# Altium schematic sheet 4_bootleg-ev-periferals.SchDoc: =ProjectTitle
size A4; Address1: github.com/4pplet/bootlegs; Address2: Licence: CERN-OHL-S; Address4: www.4pplet.com; SheetNumber: 4; SheetTotal: 4
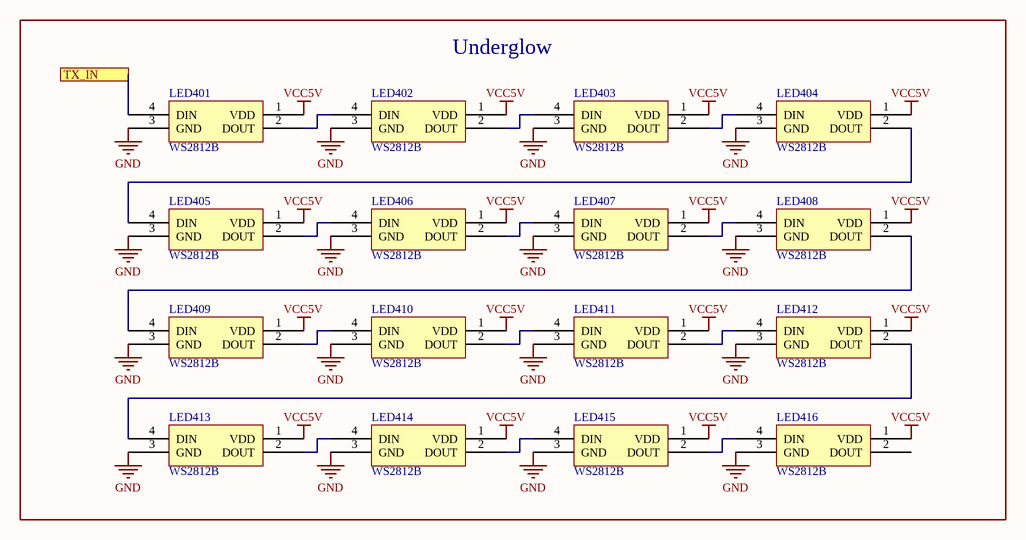
[diagram p0: 4_bootleg-ev-periferals.SchDoc]

## Parts
LED401  WS2812B  [WS2812B - 2020]
LED402  WS2812B  [WS2812B - 2020]
LED403  WS2812B  [WS2812B - 2020]
LED404  WS2812B  [WS2812B - 2020]
LED405  WS2812B  [WS2812B - 2020]
LED406  WS2812B  [WS2812B - 2020]
LED407  WS2812B  [WS2812B - 2020]
LED408  WS2812B  [WS2812B - 2020]
LED409  WS2812B  [WS2812B - 2020]
LED410  WS2812B  [WS2812B - 2020]
LED411  WS2812B  [WS2812B - 2020]
LED412  WS2812B  [WS2812B - 2020]
LED413  WS2812B  [WS2812B - 2020]
LED414  WS2812B  [WS2812B - 2020]
LED415  WS2812B  [WS2812B - 2020]
LED416  WS2812B  [WS2812B - 2020]

## Blocks framed on the sheet
Underglow: LED401-LED416

## Ports
TX_IN

## Nets
GND: LED401.3(GND) LED402.3(GND) LED403.3(GND) LED404.3(GND) LED405.3(GND) LED406.3(GND) LED407.3(GND) LED408.3(GND) LED409.3(GND) LED410.3(GND) LED411.3(GND) LED412.3(GND) LED413.3(GND) LED414.3(GND) LED415.3(GND) LED416.3(GND)
VCC5V: LED401.1(VDD) LED402.1(VDD) LED403.1(VDD) LED404.1(VDD) LED405.1(VDD) LED406.1(VDD) LED407.1(VDD) LED408.1(VDD) LED409.1(VDD) LED410.1(VDD) LED411.1(VDD) LED412.1(VDD) LED413.1(VDD) LED414.1(VDD) LED415.1(VDD) LED416.1(VDD)
TX_IN: LED401.4(DIN) ; port TX_IN
NetLED401_2: LED401.2(DOUT) LED402.4(DIN)
NetLED402_2: LED402.2(DOUT) LED403.4(DIN)
NetLED403_2: LED403.2(DOUT) LED404.4(DIN)
NetLED404_2: LED404.2(DOUT) LED405.4(DIN)
NetLED405_2: LED405.2(DOUT) LED406.4(DIN)
NetLED406_2: LED406.2(DOUT) LED407.4(DIN)
NetLED407_2: LED407.2(DOUT) LED408.4(DIN)
NetLED408_2: LED408.2(DOUT) LED409.4(DIN)
NetLED409_2: LED409.2(DOUT) LED410.4(DIN)
NetLED410_2: LED410.2(DOUT) LED411.4(DIN)
NetLED411_2: LED411.2(DOUT) LED412.4(DIN)
NetLED412_2: LED412.2(DOUT) LED413.4(DIN)
NetLED413_2: LED413.2(DOUT) LED414.4(DIN)
NetLED414_2: LED414.2(DOUT) LED415.4(DIN)
NetLED415_2: LED415.2(DOUT) LED416.4(DIN)

Not connected (* = marked no-connect by the designer): LED416 2(DOUT)

## Notes on the sheet
- Title
- Size:
- Date:
- A4
- Number:
- Time:
- Revision:
- Sheet
- of
- File:

## Library data of the parts
LED401-LED416 = WS2812B: MRF.Part: WS2812B-2020; LCSC MFG: Worldsemi; LCSC Part #: C965555